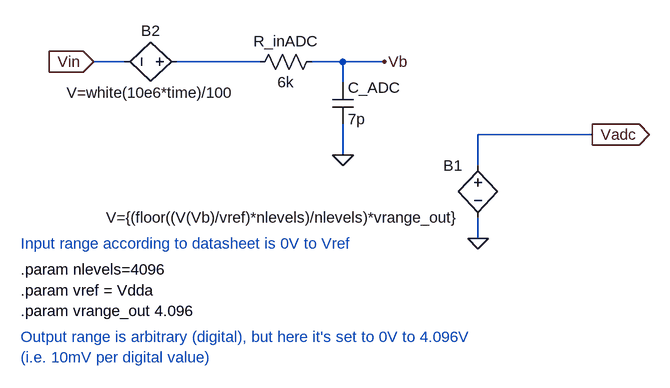
[diagram p0: schematic adc.asc]
adc.asc, the LTspice schematic file:
Version 4
SHEET 1 1824 680
WIRE -256 -336 -304 -336
WIRE -48 -336 -176 -336
WIRE 80 -336 32 -336
WIRE 144 -336 80 -336
WIRE 80 -304 80 -336
WIRE 464 -224 288 -224
WIRE 80 -192 80 -240
WIRE 288 -176 288 -224
WIRE 288 -64 288 -96
FLAG 464 -224 Vadc
IOPIN 464 -224 Out
FLAG 288 -64 0
FLAG 144 -336 Vb
FLAG 80 -192 0
FLAG -304 -336 Vin
IOPIN -304 -336 In
SYMBOL bv 288 -192 M0
SYMATTR InstName B1
SYMATTR Value V={(floor((V(Vb)/vref)*nlevels)/nlevels)*vrange_out}
SYMBOL res 48 -352 R90
WINDOW 0 0 56 VBottom 2
WINDOW 3 32 56 VTop 2
SYMATTR InstName R_inADC
SYMATTR Value 6k
SYMBOL cap 64 -304 R0
SYMATTR InstName C_ADC
SYMATTR Value 7p
SYMBOL bv -160 -336 R90
WINDOW 0 -32 56 VBottom 2
WINDOW 3 32 56 VTop 2
SYMATTR InstName B2
SYMATTR Value V=white(10e6*time)/100
TEXT -416 -16 Left 2 !.param nlevels=4096
TEXT -416 48 Left 2 !.param vrange_out 4.096
TEXT -416 -56 Left 2 ;Input range according to datasheet is 0V to Vref
TEXT -416 88 Left 2 ;Output range is arbitrary (digital), but here it's set to 0V to 4.096V\n(i.e. 10mV per digital value)
TEXT -416 16 Left 2 !.param vref = Vdda

The netlist it stands for:
* adc.asc
B1 Vadc 0 V={(floor((V(Vb)/vref)*nlevels)/nlevels)*vrange_out}
R_inADC Vb N001 6k
C_ADC Vb 0 7p
B2 N001 Vin V=white(10e6*time)/100
.param nlevels=4096
.param vrange_out 4.096
* Input range according to datasheet is 0V to Vref
* Output range is arbitrary (digital), but here it's set to 0V to 4.096V
* (i.e. 10mV per digital value)
.param vref = Vdda
.backanno
.end